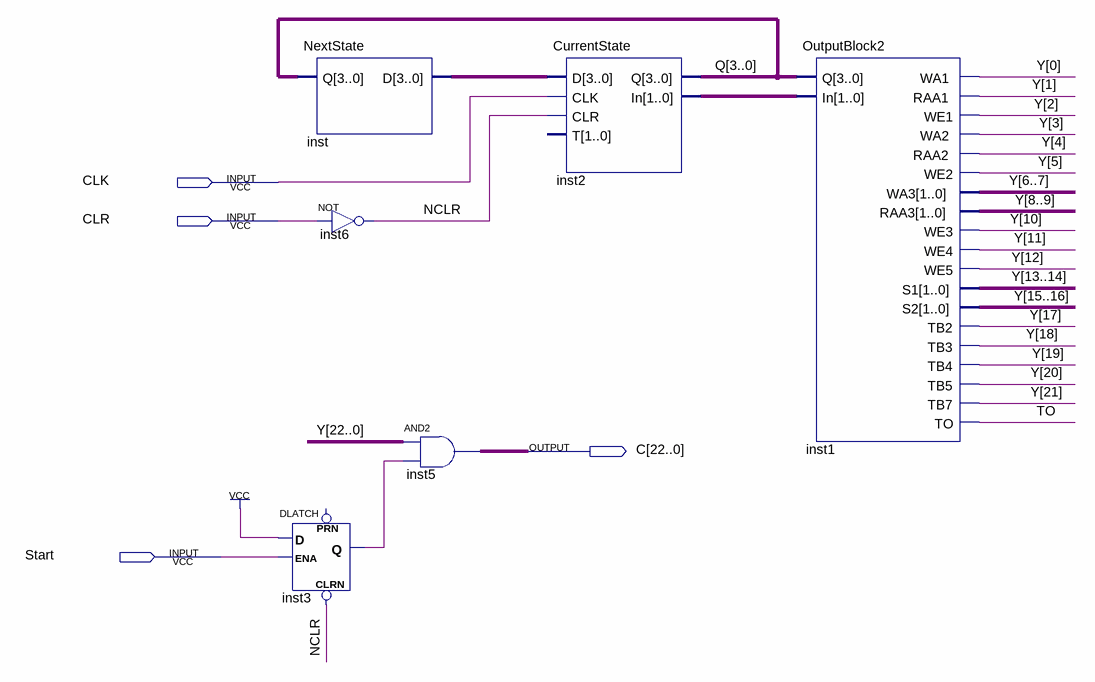
[diagram p0: schematic sheet]
// Quartus schematic Control3.bdf as structural Verilog: 6 symbols, 4 pins
module Control3 (
  input  CLK,
  input  CLR,
  input  Start,
  output [22:0] C
);

  wire inst3_q, NCLR, TO;
  wire [1:0] inst2_in;
  wire [3:0] inst_d, Q;
  wire [22:0] Y;

  NextState inst (.Q(Q), .D(inst_d));
  not inst6 (NCLR, CLR);
  DLATCH inst3 (.CLRN(NCLR), .D(1'b1), .ENA(Start), .Q(inst3_q));  // open: PRN
  assign C = Y & {23{inst3_q}};  // AND2 inst5, 23 bits wide
  CurrentState inst2 (.D(inst_d), .CLK(CLK), .CLR(NCLR), .Q(Q), .In(inst2_in));  // open: T
  OutputBlock2 inst1 (
    .Q(Q), .In(inst2_in), .WA1(Y[0]), .RAA1(Y[1]), .WE1(Y[2]), .WA2(Y[3]), .RAA2(Y[4]), .WE2(Y[5]),
    .WA3({Y[6], Y[7]}), .RAA3({Y[8], Y[9]}), .WE3(Y[10]), .WE4(Y[11]), .WE5(Y[12]), .S1({Y[13], Y[14]}),
    .S2({Y[15], Y[16]}), .TB2(Y[17]), .TB3(Y[18]), .TB4(Y[19]), .TB5(Y[20]), .TB7(Y[21]), .TO(TO));
endmodule
